# Altium schematic sheet Power_Regulators_Digital_1.SchDoc
size A4; DocumentNumber: 30; SheetNumber: 30; SheetTotal: 47
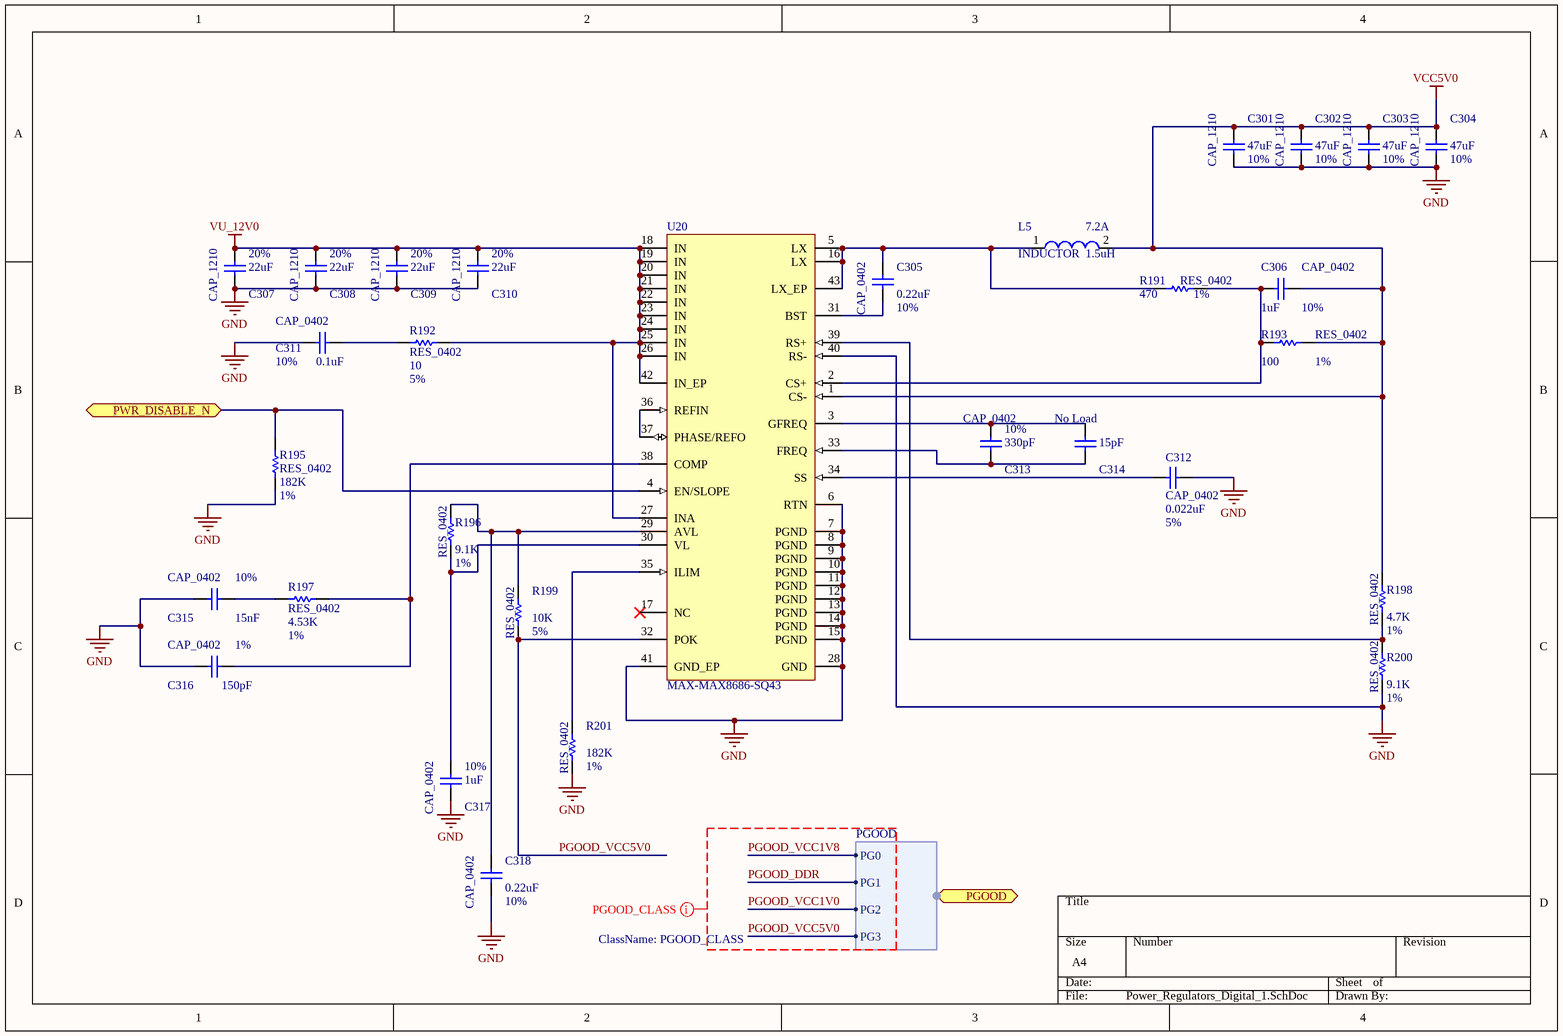
[diagram p0: Power_Regulators_Digital_1.SchDoc]

## Parts
C301  CAP_1210  value 47uF  Tolerance: 10%  [CAPC1210(3225)100_N]
C302  CAP_1210  value 47uF  Tolerance: 10%  [CAPC1210(3225)100_N]
C303  CAP_1210  value 47uF  Tolerance: 10%  [CAPC1210(3225)100_N]
C304  CAP_1210  value 47uF  Tolerance: 10%  [CAPC1210(3225)100_N]
C305  CAP_0402  value 0.22uF  Tolerance: 10%  [CAPC0402(1005)60_N]
C306  CAP_0402  value 1uF  Tolerance: 10%  [CAPC0402(1005)60_N]
C307  CAP_1210  value 22uF  Tolerance: 20%  [CAPC1210(3225)100_N]
C308  CAP_1210  value 22uF  Tolerance: 20%  [CAPC1210(3225)100_N]
C309  CAP_1210  value 22uF  Tolerance: 20%  [CAPC1210(3225)100_N]
C310  CAP_1210  value 22uF  Tolerance: 20%  [CAPC1210(3225)100_N]
C311  CAP_0402  value 0.1uF  Tolerance: 10%  [CAPC0402(1005)60_N]
C312  CAP_0402  value 0.022uF  Tolerance: 5%  [CAPC0402(1005)60_N]
C313  CAP_0402  value 330pF  Tolerance: 10%  [CAPC0402(1005)60_N]
C314  value 15pF  Manufacturer: No Load  [CAPC0201(0603)33_N]  (hidden comment: CAP_0201)
C315  CAP_0402  value 15nF  Tolerance: 10%  [CAPC0402(1005)60_N]
C316  CAP_0402  value 150pF  Tolerance: 1%  [CAPC0402(1005)60_N]
C317  CAP_0402  value 1uF  Tolerance: 10%  [CAPC0402(1005)60_N]
C318  CAP_0402  value 0.22uF  Tolerance: 10%  [CAPC0402(1005)60_N]
L5  INDUCTOR  value 1.5uH  Current: 7.2A  [Inductor_IHLP2020CZER1R5M01_2-PIN]
R191  RES_0402  value 470  Tolerance: 1%  [RESC0402(1005)_N]
R192  RES_0402  value 10  Tolerance: 5%  [RESC0402(1005)_N]
R193  RES_0402  value 100  Tolerance: 1%  [RESC0402(1005)_N]
R195  RES_0402  value 182K  Tolerance: 1%  [RESC0402(1005)_N]
R196  RES_0402  value 9.1K  Tolerance: 1%  [RESC0402(1005)_N]
R197  RES_0402  value 4.53K  Tolerance: 1%  [RESC0402(1005)_N]
R198  RES_0402  value 4.7K  Tolerance: 1%  [RESC0402(1005)_N]
R199  RES_0402  value 10K  Tolerance: 5%  [RESC0402(1005)_N]
R200  RES_0402  value 9.1K  Tolerance: 1%  [RESC0402(1005)_N]
R201  RES_0402  value 182K  Tolerance: 1%  [RESC0402(1005)_N]
U20  MAX-MAX8686-SQ43  [MAX_MAX8686_T4066M+1_N]

## Ports
PGOOD (harness PGOOD), PWR_DISABLE_N (bidir)

## Harnesses
PGOOD: PG0, PG1, PG2, PG3

## Nets
GND: C301.1 C302.1 C303.1 C304.1 C307.1 C308.1 C309.1 C310.1 C311.2 C312.2 C315.1 C316.2 C317.1 C318.1 R195.1 R200.1 R201.1 U20.6(RTN) U20.7(PGND) U20.8(PGND) U20.9(PGND) U20.10(PGND) U20.11(PGND) U20.12(PGND) U20.13(PGND) U20.14(PGND) U20.15(PGND) U20.28(GND) U20.40(RS-) U20.41(GND_EP)
VCC5V0: C301.2 C302.2 C303.2 C304.2 C306.2 L5.2 R193.2 R198.2 U20.1(CS-)
VU_12V0: C307.2 C308.2 C309.2 C310.2 R192.1 U20.18(IN) U20.19(IN) U20.20(IN) U20.21(IN) U20.22(IN) U20.23(IN) U20.24(IN) U20.25(IN) U20.26(IN) U20.27(INA) U20.42(IN_EP)
PGOOD_DDR: port PGOOD.PG1
PGOOD_VCC1V0: port PGOOD.PG2
PGOOD_VCC1V8: port PGOOD.PG0
PGOOD_VCC5V0: R199.1 U20.32(POK) ; port PGOOD.PG3
PWR_DISABLE_N: R195.2 U20.4(EN/SLOPE) ; port PWR_DISABLE_N
NetC305_1: C305.1 U20.31(BST)
NetC305_2: C305.2 L5.1 R191.1 U20.5(LX) U20.16(LX) U20.43(LX_EP)
NetC306_1: C306.1 R191.2 R193.1 U20.2(CS+)
NetC311_1: C311.1 R192.2
NetC312_1: C312.1 U20.34(SS)
NetC313_1: C313.1 C314.1 U20.33(FREQ)
NetC313_2: C313.2 C314.2 U20.3(GFREQ)
NetC315_2: C315.2 R197.1
NetC316_1: C316.1 R197.2 U20.38(COMP)
NetC317_2: C317.2 R196.1 U20.30(VL)
NetC318_2: C318.2 R196.2 R199.2 U20.29(AVL)
NetR198_1: R198.1 R200.2 U20.39(RS+)
NetR201_2: R201.2 U20.35(ILIM)
NetU20_36: U20.36(REFIN) U20.37(PHASE/REFO)

Not connected (* = marked no-connect by the designer): U20 17(NC)*

## Layout directives
net class PGOOD_CLASS: PGOOD_DDR, PGOOD_VCC1V0, PGOOD_VCC1V8, PGOOD_VCC5V0

## Library data of the parts
C301-C304 = GRM32ER71A476KE15L: 47uF, ceramic, 10% 10V X7R, 1210; Manufacturer: Murata Electronics North America; Part Number: GRM32ER71A476KE15L; Footprint Ref: CAPC1210(3225)100_N; Library Ref: CAP_1210
C305 C318 = 04026D224KAT2A: 0.22uF, ceramic, 10%, 6.3V X5R, 0402; Manufacturer: AVX Corporation; Part Number: 04026D224KAT2A; Footprint Ref: CAPC0402(1005)60_N; Library Ref: CAP_0402
C306 C317 = C1005X5R0J105K: 1uF, ceramic, 10%, 6.3V, X5R, 0402; Manufacturer: TDK Corporation; Part Number: C1005X5R0J105K; Footprint Ref: CAPC0402(1005)60_N; Library Ref: CAP_0402
C307-C310 = C1210C226M3RACTU: 22uF, ceramic, 20% 25V X7R, 1210; Manufacturer: Kemet; Part Number: C1210C226M3RACTU; Footprint Ref: CAPC1210(3225)100_N; Library Ref: CAP_1210
C311 = TMK105BJ104KV-F: 0.1uF, ceramic, 10%, 25V, X5R, 0402; Manufacturer: Taiyo Yuden; Part Number: TMK105BJ104KV-F; Footprint Ref: CAPC0402(1005)60_N; Library Ref: CAP_0402
C312 = 0402YC223JAT2A: 0.022uF, ceramic, 5% 16V X7R, 0402; Manufacturer: AVX Corporation; Part Number: 0402YC223JAT2A; Footprint Ref: CAPC0402(1005)60_N; Library Ref: CAP_0402
C313 = 0402ZC331KAT2A: 330pF, ceramic, 10% 10V X7R, 0402; Manufacturer: AVX Corporation; Part Number: 0402ZC331KAT2A; Footprint Ref: CAPC0402(1005)60_N; Library Ref: CAP_0402
C314 = No Load_15pF: Generic Capacitor; Tolerance: *; Part Number: No Load_15pF; Footprint Ref: CAPC0201(0603)33_N; Library Ref: CAP_0201
C315 = C0402C153K9PACTU: 0.015uF, ceramic, 10% 6.3V X5R, 0402; Manufacturer: Kemet; Part Number: C0402C153K9PACTU; Footprint Ref: CAPC0402(1005)60_N; Library Ref: CAP_0402
C316 = C1005C0G1H151F: 150pF, ceramic, 1% 50V NP0, 0402; Manufacturer: TDK Corporation; Part Number: C1005C0G1H151F; Footprint Ref: CAPC0402(1005)60_N; Library Ref: CAP_0402
L5 = IHLP2020CZER1R5M01: IHLP2020CZER1R5M01, 1.5uH 7.2A, SMD; Manufacturer: Vishay/Dale; Part Number: IHLP2020CZER1R5M01; Footprint Ref: Inductor_IHLP2020CZER1R5M01_2-PIN; Library Ref: INDUCTOR
R191 = RC0402FR-07470RL: 470 ohm, 1% 1/16W, 0402; Manufacturer: YAGEO; Part Number: RC0402FR-07470RL; Footprint Ref: RESC0402(1005)_N; Library Ref: RES_0402
R192 = RC0402JR-0710RL: 10 ohm, 5%, 1/16W, 0402; Manufacturer: Yageo America; Part Number: RC0402JR-0710RL; Footprint Ref: RESC0402(1005)_N; Library Ref: RES_0402
R193 = MCR01MZPF1000: 100 ohm, 1%, 1/16W, 0402; Manufacturer: ROHM; Part Number: MCR01MZPF1000; Footprint Ref: RESC0402(1005)_N; Library Ref: RES_0402
R195 R201 = ERJ-2RKF1823X: 182K ohm, 1%, 1/16W, 0402; Manufacturer: Panasonic - ECG; Part Number: ERJ-2RKF1823X; Footprint Ref: RESC0402(1005)_N; Library Ref: RES_0402
R196 R200 = ERJ-2RKF9101X: 9.1K ohm, 1% 1/10W, 0402; Manufacturer: Panasonic - ECG; Part Number: ERJ-2RKF9101X; Footprint Ref: RESC0402(1005)_N; Library Ref: RES_0402
R197 = ERJ-2RKF4531X: 4.53K ohm, 1%, 1/16W, 0402; Manufacturer: Panasonic - ECG; Part Number: ERJ-2RKF4531X; Footprint Ref: RESC0402(1005)_N; Library Ref: RES_0402
R198 = RC0402FR-074K7L: 4.7K ohm, 1%, 1/16W, 0402; Manufacturer: Yageo America; Part Number: RC0402FR-074K7L; Footprint Ref: RESC0402(1005)_N; Library Ref: RES_0402
R199 = RC0402JR-0710KL: 10K ohm, 5%, 1/16W, 0402; Manufacturer: Yageo America; Part Number: RC0402JR-0710KL; Footprint Ref: RESC0402(1005)_N; Library Ref: RES_0402
U20 = MAX8686ETL+: MAX8686ETL+, Buck Sync ADJ 25A, TQFP40-EP; Manufacturer: Maxim Integrated Products; Part Number: MAX8686ETL+